# EAGLE design usb-breakout (EAGLE 6.4)
AUTHOR: Ryan Julian (ryanjulian@berkeley.edu); REVISION: A; YEAR: 2013
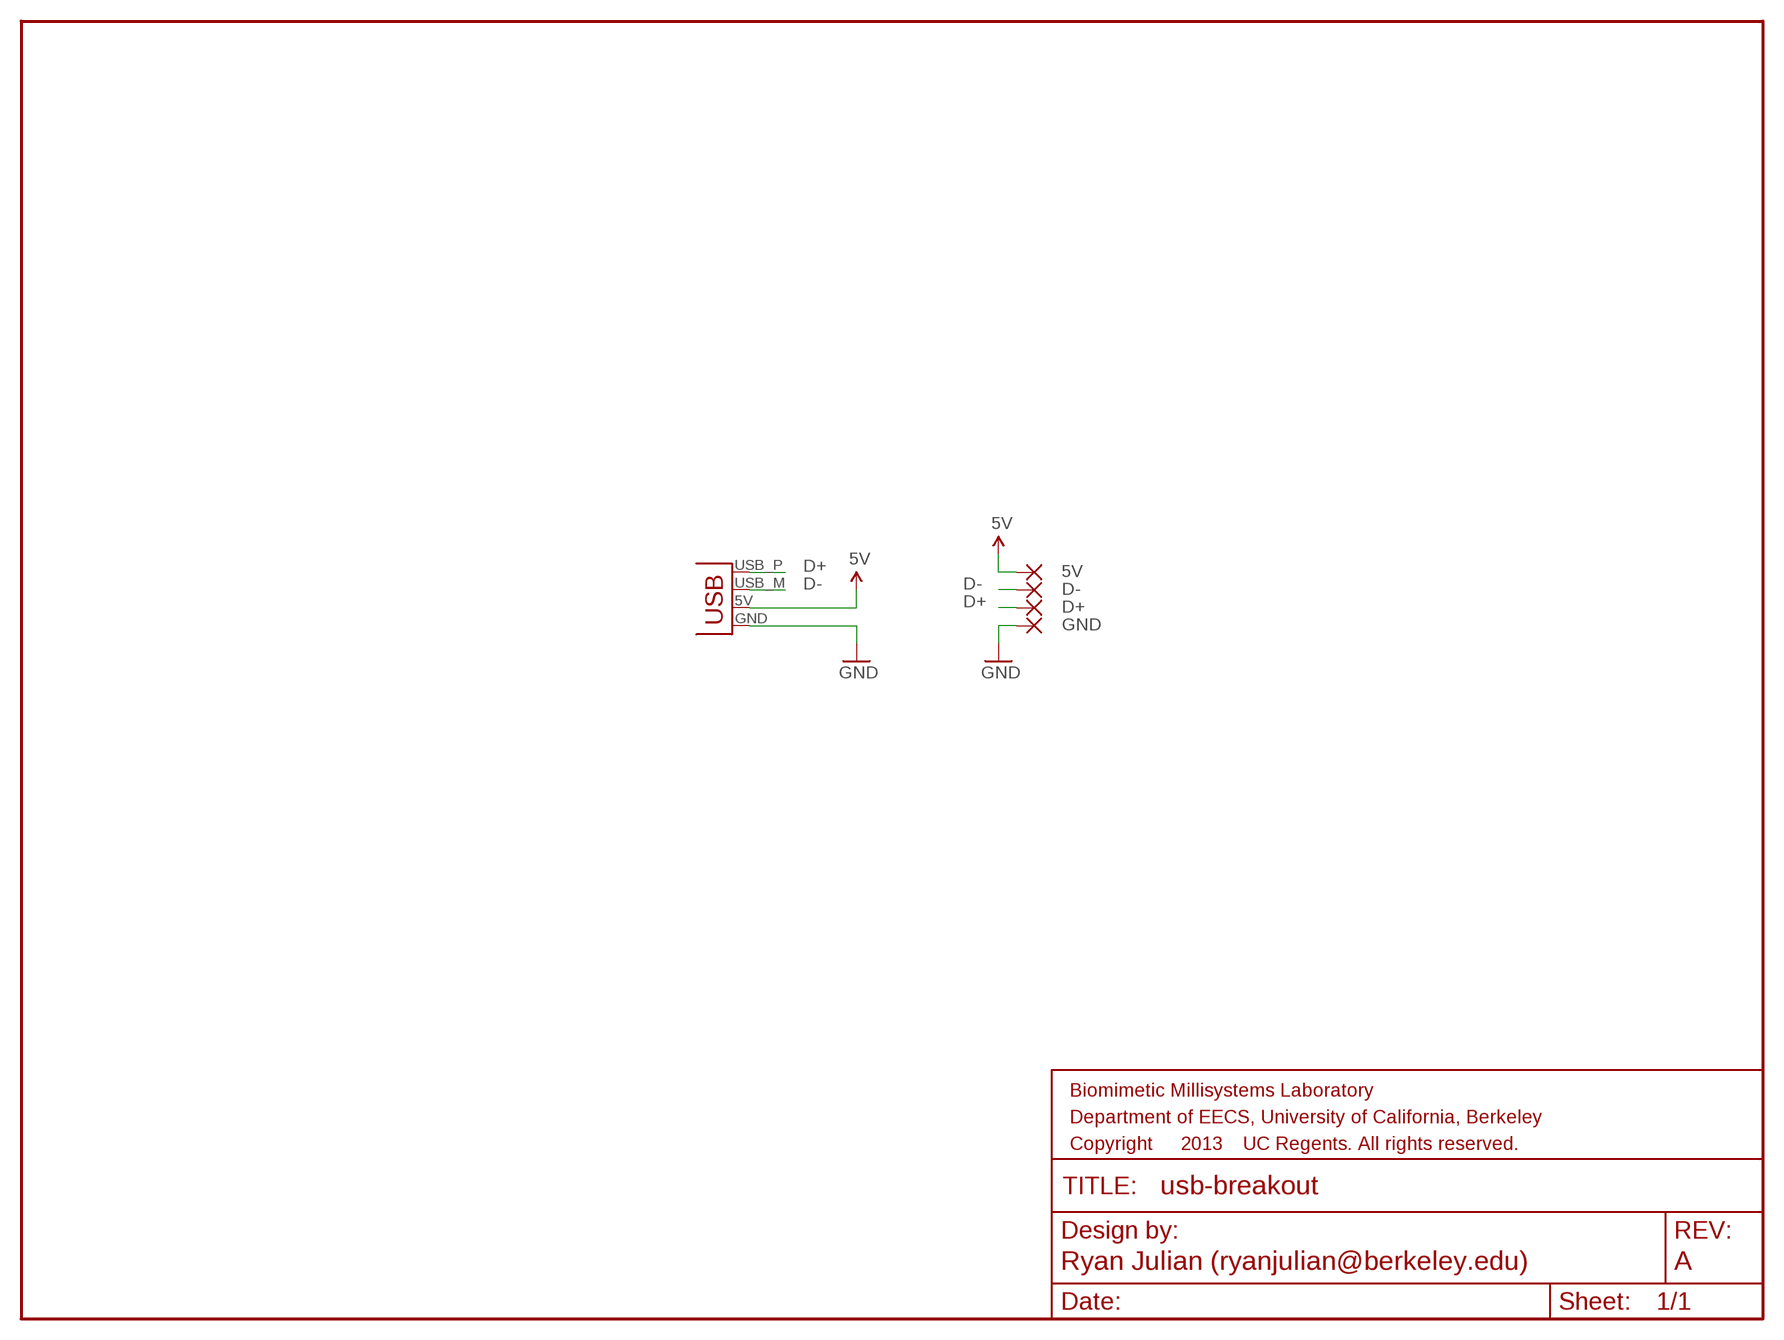
[diagram p0: schematic, sheet 1]

## Parts
JP1  USBPCB  [USB-A-PCB]
PAD1  GND  WIREPADSMD5-1,8  [5-1,8]
PAD2  D+  WIREPADSMD5-1,8  [5-1,8]
PAD3  D-  WIREPADSMD5-1,8  [5-1,8]
PAD4  5V  WIREPADSMD5-1,8  [5-1,8]

## Nets
5V: JP1.5V(VBUS) PAD4.1(P)
D+: JP1.USB_P(D+) PAD2.1(P)
D-: JP1.USB_M(D-) PAD3.1(P)
GND: JP1.GND PAD1.1(P)

## Library data of the parts
JP1 = SparkFun-Connectors:USB: USB Connectors USB-B-PTH is fully proven SKU : PRT-00139/CONN-08278 USB-miniB is fully proven SKU : PRT-00587 USB-A-PCB is untested. USB-A-H is throughly reviewed, but untested. Spark Fun Electronics SKU : PRT-00437 USB-B-SMT is throughly reviewed, but untested. Needs silkscreen touching up. USB-A-S has not been used/tested USB-MB-H has not been used/tested USB-MICROB has been used. CONN-09505
PAD1-PAD4 = wirepad:WIREPAD: Wire PAD connect wire on PCB

## Board
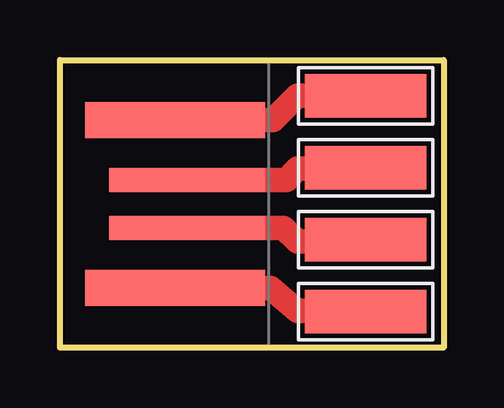
[diagram p1: board, top side]
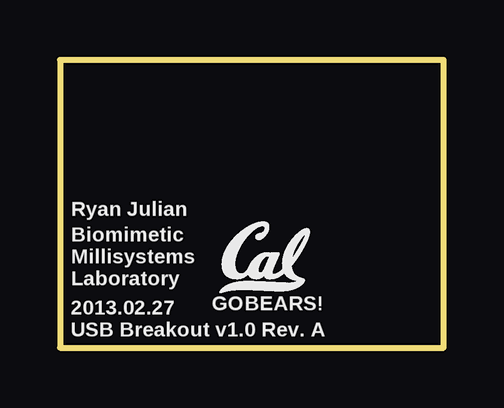
[diagram p2: board, bottom side, seen from below]

Size 16 x 12 mm. Coordinates in mm from the lower left corner, seen from the top.
Outline: 16,12 16,0 0,0 0,12 16,12
Copper layers (1*16): Top 0.035mm / dielectric 1.5mm / Bottom 0.035mm
Design rules "default": minimum track width 10mil, minimum drill 24mil, track to track 8mil, track to pad 8mil, pad to pad 8mil, via to via 8mil, smd to smd 8mil, copper to edge 40mil, drill to drill 8mil, minimum pad ring 10mil, minimum via ring 8mil, stop-mask expansion 4mil, vias tented up to drill 0mil, thermal gap 10mil

### Footprints (pad centres in the part's own frame; a part is rotated, then mirrored left to right if it is on the bottom)
USB-A-PCB = smd 7.5 x 1.5: 5V -0.2,-3.5; GND -0.2,3.5 | smd 6.5 x 1: USB_M 0.3,-1; USB_P 0.3,1
5-1,8 = smd 1.829 x 5.08: 1 0,0

### Placement (x,y rotation side)
JP1  5,6 0 top
PAD1  12.75,10.5 90 top
PAD2  12.75,7.5 90 top
PAD3  12.75,4.5 90 top
PAD4  12.75,1.5 90 top

### Tracks (layer width: path | path; a pad name or v marks a point on that pad's centre or on a via)
5V
  Top 1.016: JP1.5V 8.78,2.5 9.91,1.52 12.73,1.52 PAD4.1
D+
  Top 1.016: JP1.USB_P 9.44,7 9.91,7.47 12.72,7.47 PAD2.1
D-
  Top 1.016: JP1.USB_M 9.33,5 9.91,4.42 12.67,4.42 PAD3.1
GND
  Top 1.016: JP1.GND 8.89,9.5 9.91,10.52 12.73,10.52 PAD1.1

### Text on the board
bPlace: Ryan Julian | Biomimetic | Millisystems | Laboratory | BEARS! | GO | 2013.02.27 | USB Breakout v1.0 Rev. A